# Altium schematic sheet IMU & Connectors.SchDoc: IMU UNIT & PORTS
size 193 x 292 mm; ApprovedBy: DHARAGESWARAN S; CheckedBy: DHARAGESWARAN S; Author: DHARAGESWARAN S; CompanyName: SPD INDUSTRIES; DrawnBy: DHARAGESWARAN S; Engineer: DHARAGESWARAN S; Organization: SPD INDUSTRIES; SheetNumber: 2; SheetTotal: 3
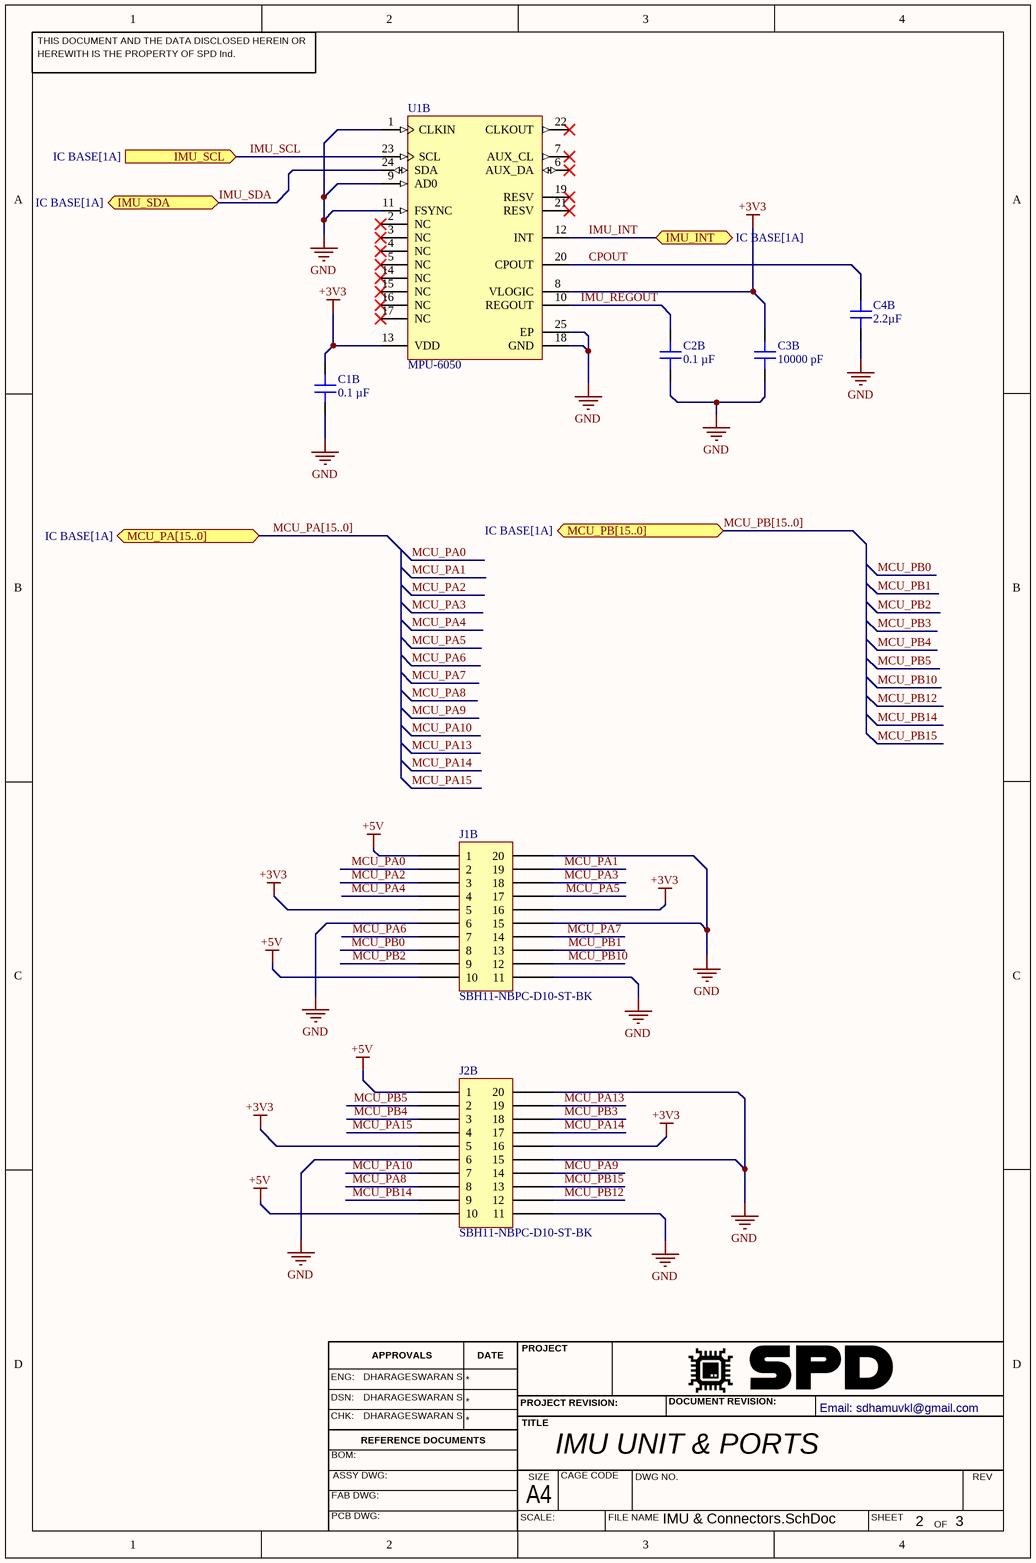
[diagram p0: IMU & Connectors.SchDoc]

## Parts
C1B  0.1 µF  [CAP 0402_1005]
C2B  0.1 µF  [CAP 0402_1005]
C3B  10000 pF  [CAP 0402_1005]
C4B  2.2µF  [CAP 0402_1005]
J1B  SBH11-NBPC-D10-ST-BK  [SULLINS SBH11-NBPC-D10-ST-BK]
J2B  SBH11-NBPC-D10-ST-BK  [SULLINS SBH11-NBPC-D10-ST-BK]
U1B  MPU-6050  [QFN50P400X400X95-24N]

## Ports
IMU_INT (bidir, see IC BASE[1A]), IMU_SCL (in, see IC BASE[1A]), IMU_SDA (bidir, see IC BASE[1A]), MCU_PA[15..0] (bidir, see IC BASE[1A]), MCU_PB[15..0] (bidir, see IC BASE[1A])

## Nets
+3V3: C1B.2 C3B.2 J1B.5 J1B.16 J2B.5 J2B.16 U1B.8(VLOGIC) U1B.13(VDD)
+5V: J1B.1 J1B.10 J2B.1 J2B.10
GND: C1B.1 C2B.1 C3B.1 C4B.1 J1B.6 J1B.11 J1B.15 J1B.20 J2B.6 J2B.11 J2B.15 J2B.20 U1B.1(CLKIN) U1B.9(AD0) U1B.11(FSYNC) U1B.18(GND) U1B.25(EP)
CPOUT: C4B.2 U1B.20(CPOUT)
IMU_INT: U1B.12(INT) ; port IMU_INT
IMU_REGOUT: C2B.2 U1B.10(REGOUT)
IMU_SCL: U1B.23(SCL) ; port IMU_SCL
IMU_SDA: U1B.24(SDA) ; port IMU_SDA
MCU_PA0: J1B.2
MCU_PA1: J1B.19
MCU_PA2: J1B.3
MCU_PA3: J1B.18
MCU_PA4: J1B.4
MCU_PA5: J1B.17
MCU_PA6: J1B.7
MCU_PA7: J1B.14
MCU_PA8: J2B.8
MCU_PA9: J2B.14
MCU_PA10: J2B.7
MCU_PA13: J2B.19
MCU_PA14: J2B.17
MCU_PA15: J2B.4
MCU_PB0: J1B.8
MCU_PB1: J1B.13
MCU_PB2: J1B.9
MCU_PB3: J2B.18
MCU_PB4: J2B.3
MCU_PB5: J2B.2
MCU_PB10: J1B.12
MCU_PB12: J2B.12
MCU_PB14: J2B.9
MCU_PB15: J2B.13

Not connected (* = marked no-connect by the designer): U1B 2(NC)* 3(NC)* 4(NC)* 5(NC)* 6(AUX_DA)* 7(AUX_CL)* 14(NC)* 15(NC)* 16(NC)* 17(NC)* 19(RESV)* 21(RESV)* 22(CLKOUT)*

## Buses and harness runs
bus MCU_PA[15..0] = port MCU_PA[15..0]
bus MCU_PB[15..0] = port MCU_PB[15..0]

## Notes on the sheet
- THIS DOCUMENT AND THE DATA DISCLOSED HEREIN OR
- HEREWITH IS THE PROPERTY OF SPD Ind.
- ENG:
- DHARAGESWARAN S
- APPROVALS
- DATE
- PROJECT
- DSN:
- CHK:
- REFERENCE DOCUMENTS
- PROJECT REVISION:
- TITLE
- DOCUMENT REVISION:
- Email: sdhamuvkl@gmail.com <https://github.com/DhamuVkl>
- BOM:
- FAB DWG:
- PCB DWG:
- ASSY DWG:
- SCALE:
- A4
- SIZE
- CAGE CODE
- FILE NAME
- DWG NO.
- SHEET
- REV
- OF

## Library data of the parts
C1B C2B = CL05B104KP5VPNC: CAP CER 100NF 10V X7R 0402; Manufacturer: Samsung Electro-Mechanics; id: 7736; Tolerance: ±10%; Part Number: CL05B104KP5VPNC; Value: 0.1 µF; Temperature Coefficient: X7R; Supplier Part Number 1: 1276-CL05B104KP5VPNCCT-ND; ComponentLink2Description: DigiKey Link; ComponentLink1URL: https://mm.digikey.com/Volume0/opasdata/d220001/medias/docus/5458/CL05B104KP5VPNC_Spec.pdf; PartId: 56690; Supplier 1: DigiKey; Series: CL; LastUpdated: 2023-11-05T20:02:55.743; Capacitance: 0.1 µF; Device Package: 0402 (1005 Metric); Ratings: AEC-Q200; Thickness (Max): 0.022" (0.55mm); Voltage - Rated: 10V; Minimum Order: 1; Packaging: TapeAndReel; Applications: Automotive; Package / Case: 0402 (1005 Metric); ComponentLink1Description: Datasheet; Price: 0.01; ComponentLink2URL: https://www.digikey.com/en/products/detail/samsung-electro-mechanics/CL05B104KP5VPNC/20498482; Lifecycle Status: Active; Operating Temperature: -55°C ~ 125°C; Size / Dimension: 0.039" L x 0.020" W (1.00mm x 0.50mm); Mounting Type: Surface Mount, MLCC
C3B = C0402C103K4REC7411: CAP CER 0402 10NF 16V X7R 10%; Manufacturer: KEMET; id: 7587; Part Number: C0402C103K4REC7411; Value: 10000 pF; Temperature Coefficient: X7R; Supplier Part Number 1: 399-C0402C103K4REC7411CT-ND; ComponentLink2Description: DigiKey Link; ComponentLink1URL: https://connect.kemet.com:7667/gateway/IntelliData-ComponentDocumentation/1.0/download/datasheet/C0402C103K4REC7411; PartId: 56100; Tolerance: ±10%; Supplier 1: DigiKey; Series: ESD SMD Comm X7R; LastUpdated: 2023-08-20T19:02:59.890; Capacitance: 10000 pF; Device Package: 0402 (1005 Metric); Thickness (Max): 0.022" (0.55mm); Voltage - Rated: 16V; Minimum Order: 1; Packaging: TapeAndReel; Applications: ESD Protection; Package / Case: 0402 (1005 Metric); ComponentLink1Description: Datasheet; Price: 0.01; ComponentLink2URL: https://www.digikey.com/en/products/detail/kemet/C0402C103K4REC7411/8645017; Lifecycle Status: Active; Operating Temperature: -55°C ~ 125°C; Size / Dimension: 0.039" L x 0.020" W (1.00mm x 0.50mm); Mounting Type: Surface Mount, MLCC
C4B = 0402ZD225KAT2A: CAP CER 2.2UF 10V X5R 0402; Manufacturer: AVX Corporation; id: 2335; Tolerance: ±10%; Part Number: 0402ZD225KAT2A; Value: 2.2µF; Temperature Coefficient: X5R; Supplier Part Number 1: 478-10072-1-ND; ComponentLink2Description: DigiKey Link; ComponentLink1URL: http://datasheets.avx.com/cx5r.pdf; PartId: 9346; Supplier 1: DigiKey; Series: -; LastUpdated: 2022-02-08T12:26:45.707; Part Status: Active; Capacitance: 2.2µF; Device Package: 0402 (1005 Metric); Thickness (Max): 0.022" (0.56mm); Voltage - Rated: 10V; Minimum Order: 1; Packaging: TapeAndReel; Applications: General Purpose; Package / Case: 0402 (1005 Metric); ComponentLink1Description: Datasheet; Price: 0.09; ComponentLink2URL: http://digikey.com/product-detail/en/avx-corporation/0402ZD225KAT2A/478-10072-1-ND/6564294; Lifecycle Status: Active; Operating Temperature: -55°C ~ 85°C; Size / Dimension: 0.039" L x 0.020" W (1.00mm x 0.50mm); Mounting Type: Surface Mount, MLCC
J1B J2B = SBH11-NBPC-D10-ST-BK: CONN HEADER VERT 20POS 2.54MM; Manufacturer: Sullins Connector Solutions; id: 135; Style: Board to Board or Cable; Current Rating (Amps): 3A; Number Of Positions: 20; Number Of Positions Loaded: All; Shrouding: Shrouded - 4 Wall; Material Flammability Rating: UL94 V-0; Part Number: SBH11-NBPC-D10-ST-BK; Supplier Part Number 1: SBH11-NBPC-D10-ST-BK-ND; Contact Shape: Square; Termination: Solder; ComponentLink1Description: Datasheet; Connector Type: Header; Contact Material: Brass; ComponentLink2URL: http://digikey.com/product-detail/en/sullins-connector-solutions/SBH11-NBPC-D10-ST-BK/SBH11-NBPC-D10-ST-BK-ND/4558585; Contact Finish - Mating: Gold; Features: Keying Slot; ComponentLink1URL: https://s3.amazonaws.com/catalogspreads-pdf/PAGE122%20.100%20SBH11%20SERIES%20MALE%20BOX%20HDR%20ST%20RA%20SMT.pdf; Fastening Type: Push-Pull; Supplier 1: DigiKey; Number Of Rows: 2; Series: SBH11; Part Status: Active; ComponentLink2Description: DigiKey Link; Contact Type: Male Pin; Packaging: Tray; Contact Finish - Post: Gold; Contact Finish Thickness - Mating: Flash; Minimum Order: 1000; PartId: 135; Lifecycle Status: Active; LastUpdated: 2022-06-21T14:45:11.303; Operating Temperature: -40°C ~ 105°C; Insulation Color: Black; Mounting Type: Through Hole; Insulation Material: Polyamide (PA), Nylon; Price: 0.40
U1B = MPU-6050: MPU-6050 series Accelerometer, Gyroscope, 3 Axis Sensor Evaluation Board; MF: TDK InvenSense; SnapEDA_Link: https://www.snapeda.com/parts/MPU-6050/TDK+InvenSense/view-part/?ref=snap; Package: QFN-24 InvenSense; Value: *; MP: MPU-6050; Check_prices: https://www.snapeda.com/parts/MPU-6050/TDK+InvenSense/view-part/?ref=eda; Supplier 1: Digikey; Supplier Part Number 1: 1428-1007-1-ND